# Altium schematic sheet Main_TopSheet.SchDoc
size A4; SheetNumber: 1; SheetTotal: 7
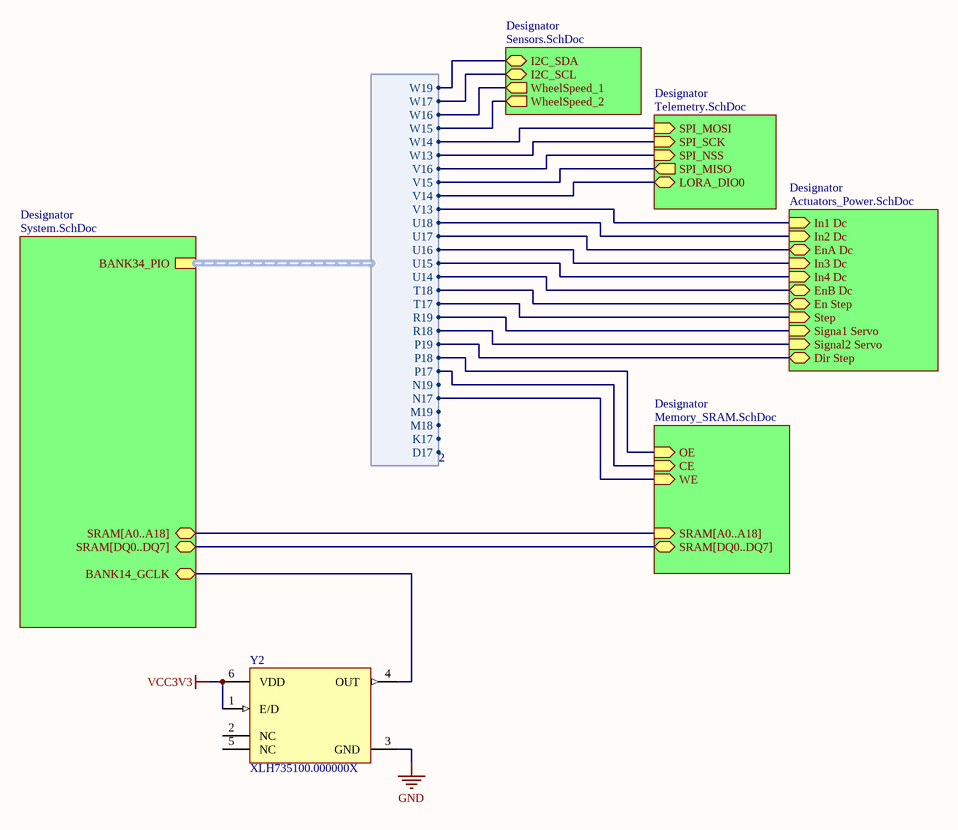
[diagram p0: Main_TopSheet.SchDoc]

## Parts
Y2  XLH735100.000000X  [JU6_MFG]

## Sub-sheets
Designator = Sensors.SchDoc: I2C_SDA (bidir), I2C_SCL (bidir), WheelSpeed_1 (out), WheelSpeed_2 (out)
Designator = Telemetry.SchDoc: SPI_MOSI (in), SPI_SCK (in), SPI_NSS (in), SPI_MISO (out), LORA_DIO0 (bidir)
Designator = Actuators_Power.SchDoc: In1 Dc (in), In2 Dc (in), EnA Dc (bidir), In3 Dc (in), In4 Dc (in), EnB Dc (bidir), En Step (bidir), Step (in), Signa1 Servo (in), Signal2 Servo (in), Dir Step (bidir)
Designator = System.SchDoc: BANK34_PIO (harness 2), BANK14_GCLK (bidir), SRAM[A0..A18] (bidir), SRAM[DQ0..DQ7] (bidir)
Designator = Memory_SRAM.SchDoc: CE (in), OE (in), WE (in), SRAM[A0..A18] (in), SRAM[DQ0..DQ7] (bidir)

## Harnesses
2: D17, K17, M18, M19, N17, N19, P17, P18, P19, R18, R19, T17, T18, U14, U15, U16, U17, U18, V13, V14, V15, V16, W13, W14, W15, W16, W17, W19

## Nets
GND: Y2.3(GND)
VCC3V3: Y2.1(E/D) Y2.6(VDD)
NetY2_4: Y2.4(OUT) ; sheet Designator/BANK14_GCLK
(unnamed): sheet Designator/I2C_SDA, sheet Designator/BANK34_PIO.W19
(unnamed): sheet Designator/I2C_SCL, sheet Designator/BANK34_PIO.W17
(unnamed): sheet Designator/WheelSpeed_1, sheet Designator/BANK34_PIO.W16
(unnamed): sheet Designator/WheelSpeed_2, sheet Designator/BANK34_PIO.W15
(unnamed): sheet Designator/SPI_MOSI, sheet Designator/BANK34_PIO.W14
(unnamed): sheet Designator/SPI_SCK, sheet Designator/BANK34_PIO.W13
(unnamed): sheet Designator/SPI_NSS, sheet Designator/BANK34_PIO.V16
(unnamed): sheet Designator/SPI_MISO, sheet Designator/BANK34_PIO.V15
(unnamed): sheet Designator/LORA_DIO0, sheet Designator/BANK34_PIO.V14
(unnamed): sheet Designator/In1 Dc, sheet Designator/BANK34_PIO.V13
(unnamed): sheet Designator/In2 Dc, sheet Designator/BANK34_PIO.U18
(unnamed): sheet Designator/EnA Dc, sheet Designator/BANK34_PIO.U17
(unnamed): sheet Designator/In3 Dc, sheet Designator/BANK34_PIO.U16
(unnamed): sheet Designator/In4 Dc, sheet Designator/BANK34_PIO.U15
(unnamed): sheet Designator/EnB Dc, sheet Designator/BANK34_PIO.U14
(unnamed): sheet Designator/En Step, sheet Designator/BANK34_PIO.T18
(unnamed): sheet Designator/Step, sheet Designator/BANK34_PIO.T17
(unnamed): sheet Designator/Signa1 Servo, sheet Designator/BANK34_PIO.R19
(unnamed): sheet Designator/Signal2 Servo, sheet Designator/BANK34_PIO.R18
(unnamed): sheet Designator/Dir Step, sheet Designator/BANK34_PIO.P19
(unnamed): sheet Designator/CE, sheet Designator/BANK34_PIO.P17
(unnamed): sheet Designator/OE, sheet Designator/BANK34_PIO.P18
(unnamed): sheet Designator/WE, sheet Designator/BANK34_PIO.N17

Not connected (* = marked no-connect by the designer): Y2 2(NC) 5(NC)

## Library data of the parts
Y2 = CMP-00572-106941302-3: Crystal ROHS3Compliant Enable/Disable Active Oscillator -20C~70C 47mA 0.055 1.40mm 100MHz; Max Output Frequency: 999.9MHz; Min Input Voltage: 3.135V; Output Type: LVCMOS; Max Input Voltage: 3.465V; ComponentLink1Description: Manufacturer's Website; ComponentLink2URL: https://octopart.com/cad-content/api/get-model-datasheet/15189/106941302; Case/Package: CLCC; Number of Pins: 6; Mount: Surface Mount; ComponentLink2Description: Datasheet URL; Min Operating Temperature: -20°C; HelpURL: https://octopart.com/cad-content/api/get-model-datasheet/15189/106941302; ComponentLink3Description: Manufacturer's Package Drawing; RoHS: Compliant; ComponentLink3URL: https://www.renesas.com/en/document/psc/ju6-package-outline-70-x-50-mm-body-13-mm-thick; Height: 1.45mm; Max Operating Temperature: 70°C; ComponentLink1URL: http://www.renesas.com